# EasyEDA schematic SCH_hEART-led_2026-05-04.json
TITLE: Sheet_1; REV: 1.0; Date: 2026-04-21; Sheet: 1/1; Drawn By: edrickevinpena; Company: Your Company
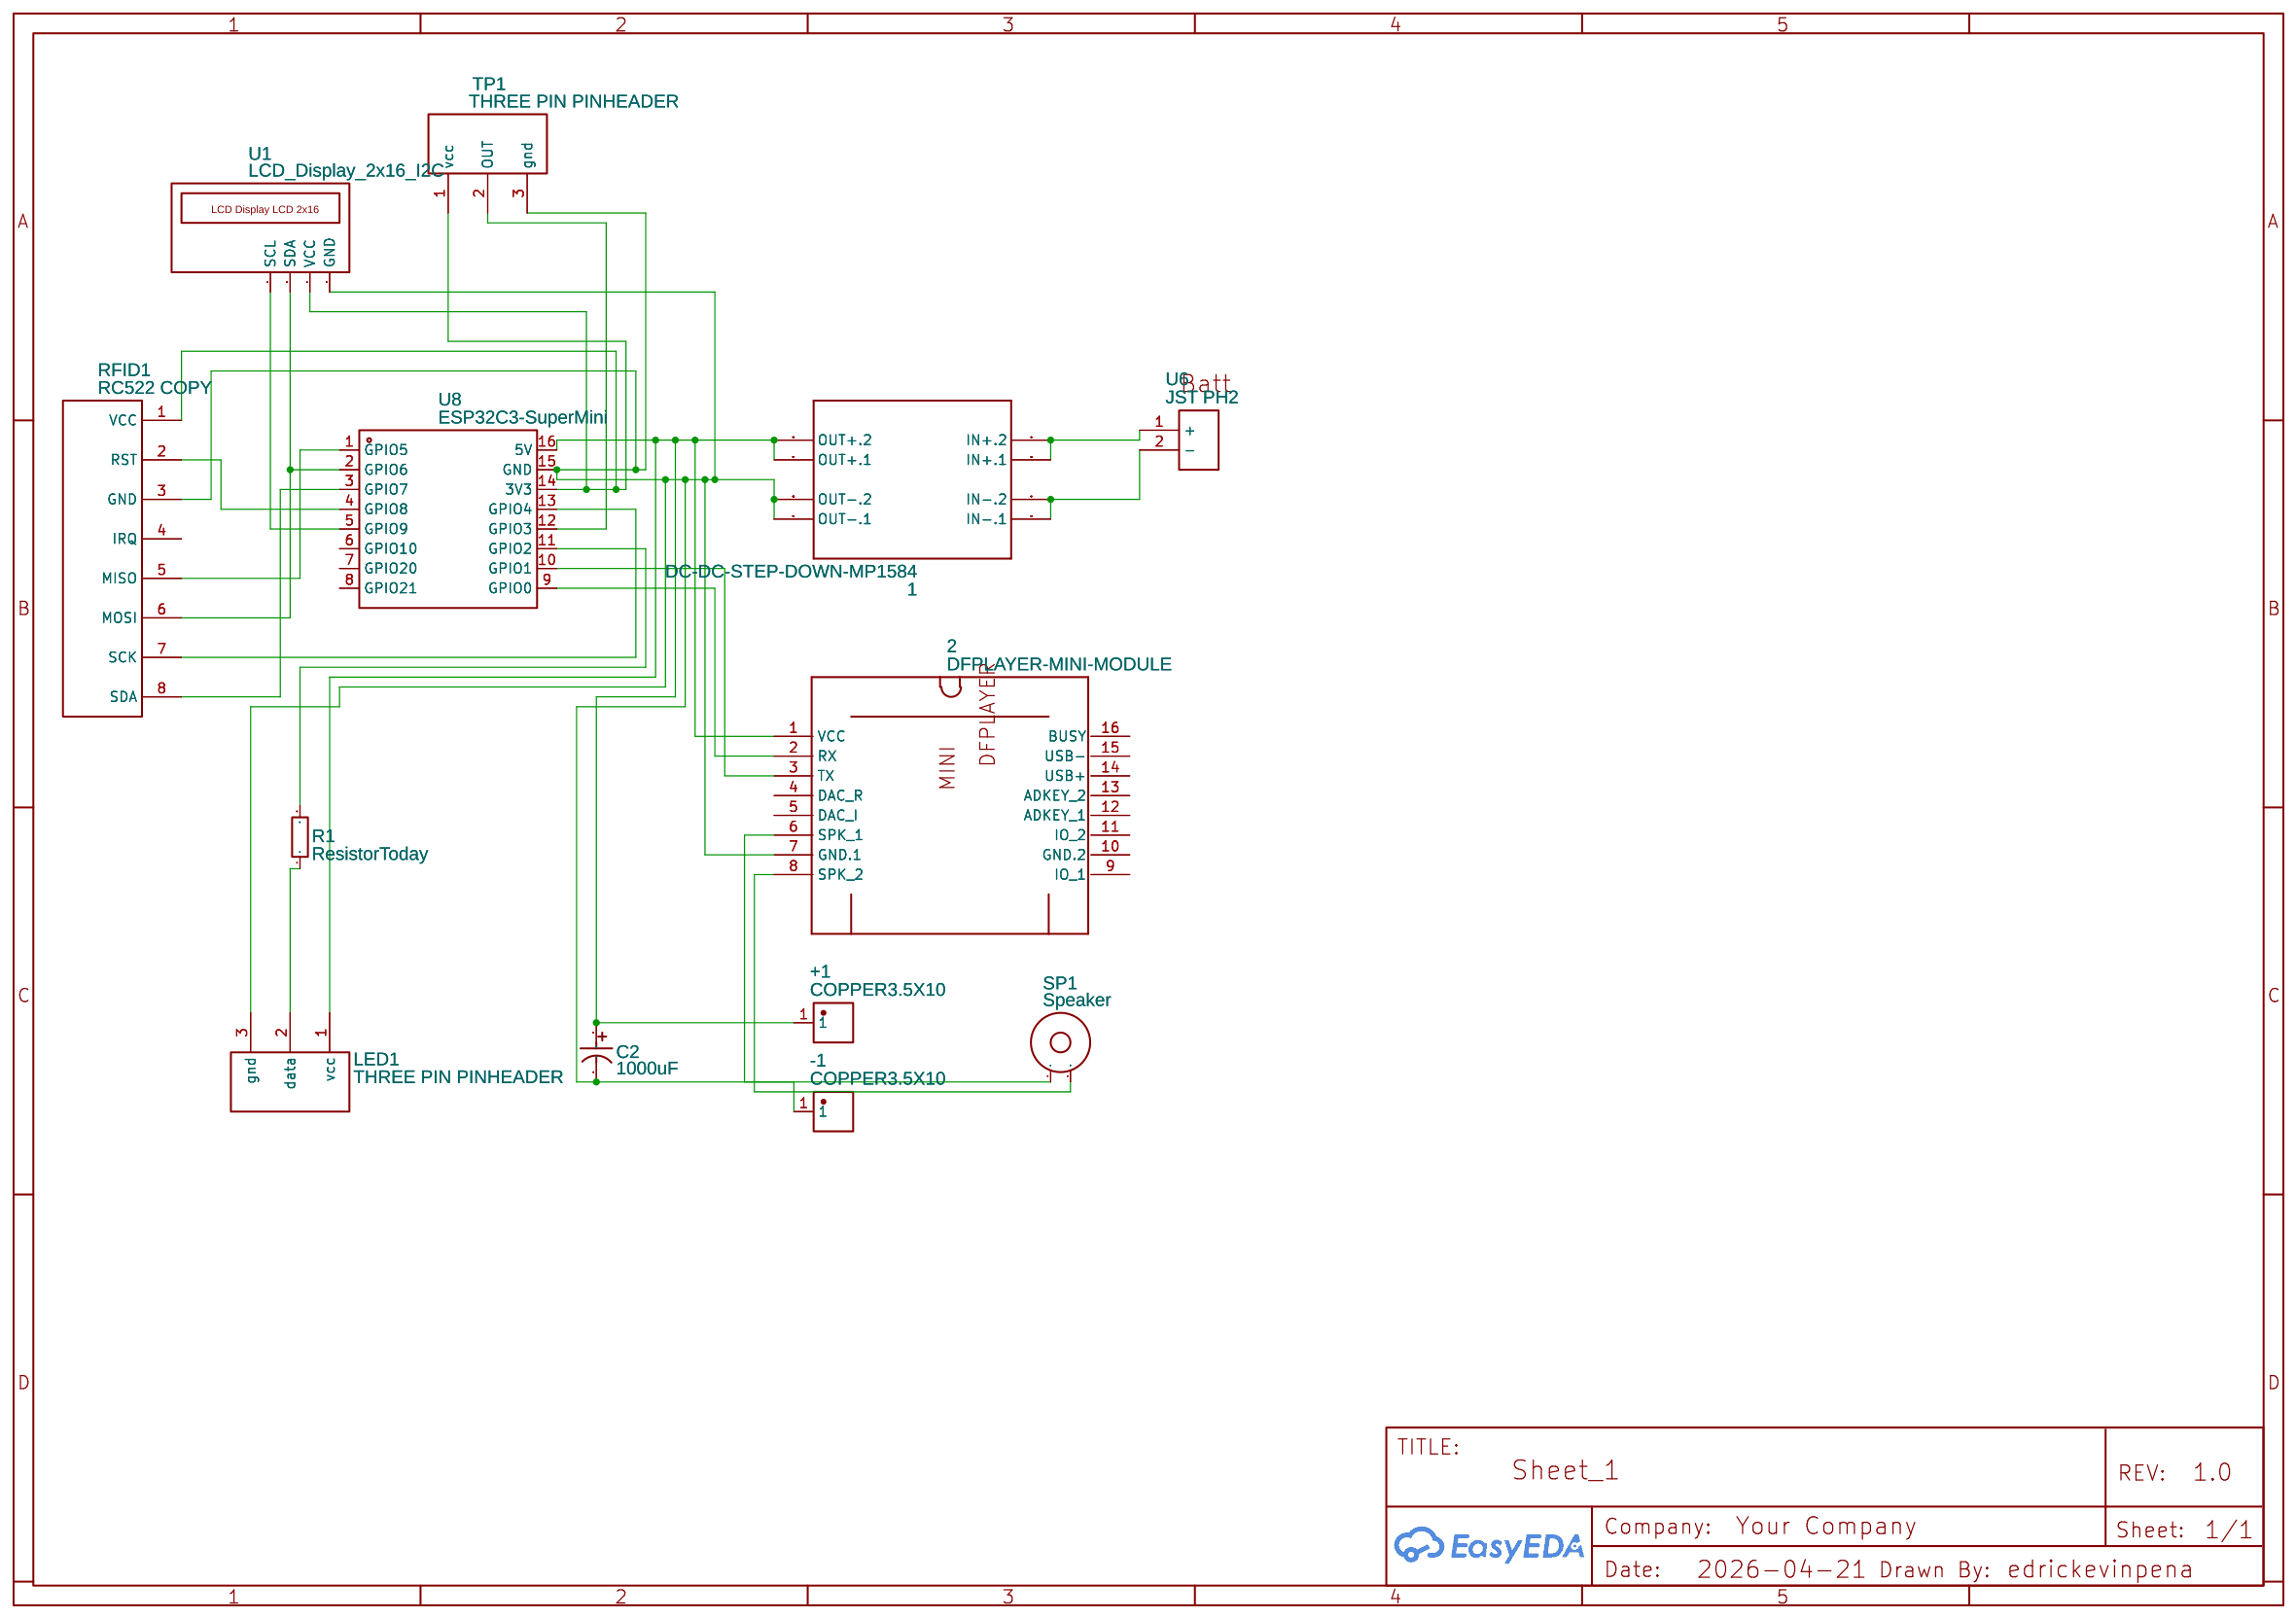
[diagram p0: schematic sheet]

## Parts
1  DC-DC-STEP-DOWN-MP1584  [DC-DC-STEP-DOWN-MP1584]
2  DFPLAYER-MINI-MODULE  [DFPLAYER-MINI-MODULE]
+1  COPPER3.5X10  [SMD_L10.0-W3.5]
-1  COPPER3.5X10  [SMD_L10.0-W3.5]
C2  1000uF  [SARAWUT_C1000UF]
LED1  THREE PIN PINHEADER  [THREE PIN PINHEADER]
R1  ResistorToday  [FIXED RESISTOR]
RFID1  RC522 COPY  [RFID-RC522]
SP1  Speaker  [SPEAKER]
TP1  THREE PIN PINHEADER  [THREE PIN PINHEADER]
U1  LCD_Display_2x16_I2C  [LCD_DISPLAY_2X16_I2C]
U6  JST PH2  [JST-PH-JST-PH2]
U8  ESP32C3-SuperMini  [ESP32-C3_SUPERMINI:MODULE_ESP32-C3_SUPERMINI]

## Library data of the parts
1 = DC-DC-STEP-DOWN-MP1584: Contributor: rowenaminong
2 = DFPLAYER-MINI-MODULE: Contributor: arenda1234
+1 -1 = COPPER3.5X10: Contributor: lcsc; Supplier: LCSC; Supplier Part: C9900023671; Manufacturer: null; JLCPCB Part Class: Extended Part
C2 = 1000UF 50V: Supplier: LCSC; Manufacturer: CX(承兴); Manufacturer Part: KM108M050J25RR0VH2FP0; Supplier Part: C18104; JLCPCB Part Class: Extended Part
LED1 TP1 = THREE PIN PINHEADER: Contributor: durgesh_123
R1 = RESISTOR NORMAL COPY: Supplier: LCSC; Supplier Part: X16151710; Manufacturer Part: EWWR0001J20R0T9; Contributor: MehmetCan94
RFID1 = RC522 COPY: Contributor: Baptiste Campion; subpart_no: 1
SP1 = Speaker: Contributor: accountuser
U1 = LCD_Display_2x16_I2C: Supplier: Joy-IT; Contributor: rstmsvk
U6 = JST PH2: Contributor: pwarrow99
U8 = ESP32C3-SuperMini: Symbol: ESP32C3-SUPERMINI; Supplier Part: C9900147397; Supplier Footprint: SMD-16P; JLCPCB Part Class: Extended Part; Supplier: LCSC; Add into BOM: yes; Convert to PCB: yes; Contributor: muhammadbilalma

## Nets
Net-(1-IN+.1): 1.IN+.1 1.IN+.2 U6.1(+)
Net-(1-IN-.1): 1.IN-.1 1.IN-.2 U6.2(-)
Net-(1-OUT+.1): 1.OUT+.1 1.OUT+.2 2.1(VCC) +1.1 C2.1 LED1.1(vcc) U8.16(5V)
Net-(1-OUT-.1): 1.OUT-.1 1.OUT-.2 2.7(GND.1) -1.1 C2.2 LED1.3(gnd) RFID1.3(GND) TP1.3(gnd) U1.1(GND) U8.15(GND)
Net-(2-2): 2.2(RX) U8.9(GPIO0)
Net-(2-3): 2.3(TX) U8.10(GPIO1)
Net-(2-6): 2.6(SPK_1) SP1.1
Net-(2-8): 2.8(SPK_2) SP1.2
Net-(LED1-2): LED1.2(data) R1.1
Net-(R1-2): R1.2 U8.11(GPIO2)
Net-(RFID1-1): RFID1.1(VCC) TP1.1(vcc) U1.2(VCC) U8.14(3V3)
Net-(RFID1-2): RFID1.2(RST) U8.4(GPIO8)
Net-(RFID1-5): RFID1.5(MISO) U8.1(GPIO5)
Net-(RFID1-6): RFID1.6(MOSI) U1.3(SDA) U8.2(GPIO6)
Net-(RFID1-7): RFID1.7(SCK) U8.13(GPIO4)
Net-(RFID1-8): RFID1.8(SDA) U8.3(GPIO7)
Net-(TP1-2): TP1.2(OUT) U8.12(GPIO3)
Net-(U1-4): U1.4(SCL) U8.5(GPIO9)

Not connected (* = marked no-connect by the designer): 2 4(DAC_R) 5(DAC_I) 9(IO_1) 10(GND.2) 11(IO_2) 12(ADKEY_1) 13(ADKEY_2) 14(USB+) 15(USB-) 16(BUSY); RFID1 4(IRQ); U8 6(GPIO10) 7(GPIO20) 8(GPIO21)
